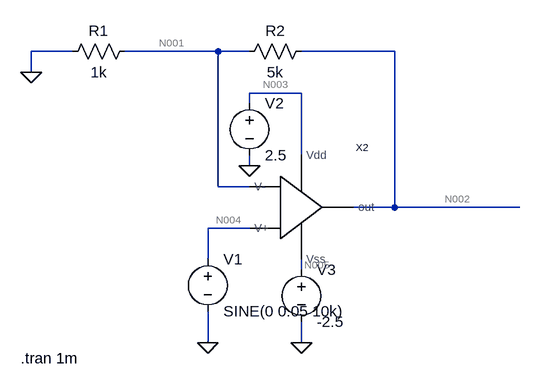
[diagram p0: schematic tran.asc]
tran.asc, the LTspice schematic file:
Version 4
SHEET 1 880 680
WIRE -848 -336 -912 -336
WIRE -624 -336 -768 -336
WIRE -576 -336 -624 -336
WIRE -352 -336 -496 -336
WIRE -912 -304 -912 -336
WIRE -496 -272 -576 -272
WIRE -576 -256 -576 -272
WIRE -496 -176 -496 -272
WIRE -576 -160 -576 -176
WIRE -624 -128 -624 -336
WIRE -576 -128 -624 -128
WIRE -352 -96 -352 -336
WIRE -352 -96 -416 -96
WIRE -160 -96 -352 -96
WIRE -576 -64 -640 -64
WIRE -640 -16 -640 -64
WIRE -496 0 -496 -16
WIRE -640 112 -640 64
WIRE -496 112 -496 80
FLAG -640 112 0
FLAG -496 112 0
FLAG -576 -160 0
FLAG -912 -304 0
SYMBOL res -480 -352 R90
WINDOW 0 0 56 VBottom 2
WINDOW 3 32 56 VTop 2
SYMATTR InstName R2
SYMATTR Value 5k
SYMBOL voltage -640 -32 R0
WINDOW 123 0 0 Left 0
WINDOW 39 0 0 Left 0
SYMATTR InstName V1
SYMATTR Value SINE(0 0.05 10k)
SYMBOL voltage -576 -272 R0
WINDOW 123 0 0 Left 0
WINDOW 39 0 0 Left 0
SYMATTR InstName V2
SYMATTR Value 2.5
SYMBOL voltage -496 -16 R0
WINDOW 123 0 0 Left 0
WINDOW 39 0 0 Left 0
SYMATTR InstName V3
SYMATTR Value -2.5
SYMBOL res -752 -352 R90
WINDOW 0 0 56 VBottom 2
WINDOW 3 32 56 VTop 2
SYMATTR InstName R1
SYMATTR Value 1k
SYMBOL OPAMP -608 -96 R0
SYMATTR InstName X2
TEXT -928 136 Left 2 !.tran 1m

The netlist it stands for:
* tran.asc
R2 N002 N001 5k
V1 N004 0 SINE(0 0.05 10k)
V2 N003 0 2.5
V3 N005 0 -2.5
R1 N001 0 1k
XX2 N003 N005 N001 N004 N002 OPAMP  ; pins Vdd Vss V- V+ out
.tran 1m
.backanno
.end

* Results of the author's LTspice run, read from the files saved beside the schematic
* Operating Point, zero values left out:
*   V(n002) = 285.5 µV
*   V(n001) = 47.58 µV
*   V(n003) = 2.5 V
*   V(n005) = -2.5 V
*   I(R2) = 47.58 nA
*   I(R1) = 47.58 nA
*   I(V2) = -188.5 µA
*   I(V3) = 188.4 µA
*   Ix(x2:VDD) = 188.5 µA
*   Ix(x2:VSS) = -188.4 µA
*   Ix(x2:OUT) = -47.58 nA
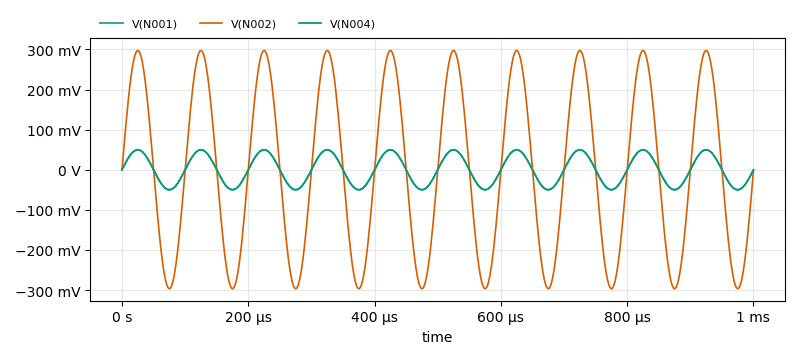
[diagram p1: Transient Analysis of tran.asc, plotted from the saved traces]
* Transient Analysis, 1 run:
*   V(N001): min -49.47 mV, max 49.63 mV, average 65.42 µV, rms 35.04 mV, last -450.2 µV
*   V(N002): min -296.8 mV, max 297.8 mV, average 392.5 µV, rms 210.2 mV, last -2.701 mV
*   V(N004): min -50 mV, max 50 mV, average -40 nV, rms 35.36 mV, last 0 V